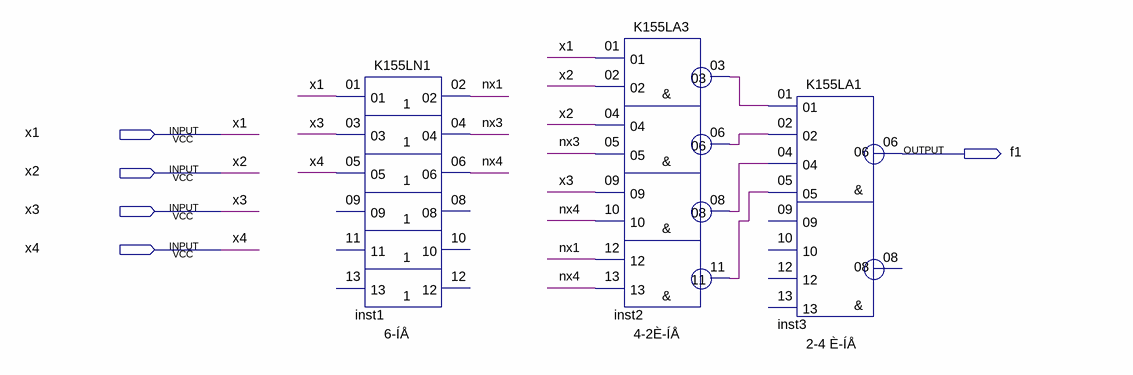
[diagram p0: schematic sheet]
// Quartus schematic lab1_scheme1.bdf as structural Verilog: 3 symbols, 5 pins
module lab1_scheme1 (
  input  x1,
  input  x2,
  input  x3,
  input  x4,
  output f1
);

  wire inst2_03, inst2_06, inst2_08, inst2_11, nx1, nx3, nx4;

  K155LN1 inst1 (.\01 (x1), .\03 (x3), .\05 (x4), .\02 (nx1), .\04 (nx3), .\06 (nx4));  // open: 09, 11, 13, 08, 10, 12
  K155LA3 inst2 (
    .\01 (x1), .\02 (x2), .\04 (x2), .\05 (nx3), .\09 (x3), .\10 (nx4), .\12 (nx1), .\13 (nx4),
    .\03 (inst2_03), .\06 (inst2_06), .\08 (inst2_08), .\11 (inst2_11));
  K155LA1 inst3 (
    .\01 (inst2_03), .\02 (inst2_06), .\04 (inst2_08), .\05 (inst2_11), .\06 (f1));  // open: 09, 10, 12, 13, 08
endmodule
